# Altium schematic sheet capacitors.SchDoc
size 420 x 297 mm; Address1: Address1; Address2: Address2; Address3: Address3; Address4: Address4; SheetNumber: 1; Scale: 1:1; Разраб.: Иванов; Обозначение документа: АБВГ.123456.001 Э3; Пров.: Петров; Утв.: Сидоров; Наименование организации: ОАО "Концерн "МПО-Гидроприбор"; Перв. применение: АБВГ.123456.000; Наименование изделия 1: Плата; Наименование изделия 2: Схема электрическая; Наименование изделия 3: принципиальная; Нач. отд.: Нач. отд.; Фамилия нач. отд.: Сидоров
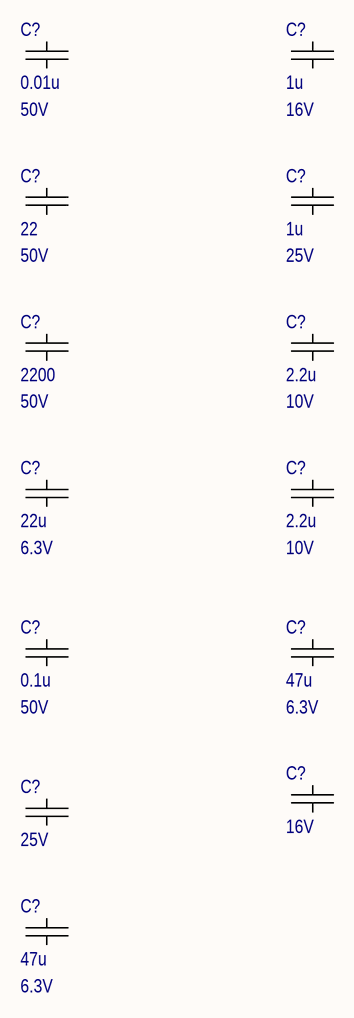
[diagram p0: capacitors.SchDoc]

## Parts
(Parts that share a designator on the sheet are numbered #1, #2 ... from top to bottom, then left to right.)
C?#1  value 0.01u  Voltage/Power: 50V  [C0603_IPC]
C?#2  value 1u  Voltage/Power: 16V  [C0603_IPC]
C?#3  value 22  Voltage/Power: 50V  [C0603_IPC]
C?#4  value 1u  Voltage/Power: 25V  [C0603_IPC]
C?#5  value 2200  Voltage/Power: 50V  [C0603_IPC]
C?#6  value 2.2u  Voltage: 10V  [C0603_IPC]  (hidden comment: 2.2u 10V)
C?#7  value 22u  Voltage/Power: 6.3V  [C0805_IPC]
C?#8  value 2.2u  Voltage/Power: 10V  [C0603_IPC]
C?#9  value 0.1u  Voltage/Power: 50V  [C0603_IPC]
C?#10  value 47u  Voltage/Power: 6.3V  [C0805_IPC]
C?#11  Voltage/Power: 16V  [C0603_IPC]
C?#12  Voltage/Power: 25V  [C0603_IPC]
C?#13  value 47u  Voltage/Power: 6.3V  [C0805_IPC]

## Nets

Not connected (* = marked no-connect by the designer): C?#1 1 2; C?#2 1 2; C?#3 1 2; C?#4 1 2; C?#5 1 2; C?#6 1 2; C?#7 1 2; C?#8 1 2; C?#9 1 2; C?#10 1 2; C?#11 1 2; C?#12 1 2; C?#13 1 2

## Notes on the sheet
- Перв. примен.
- Справ. №
- Подп. и дата
- Инв. № дубл.
- Взам. инв. №
- Разраб.
- Изм.
- Лист
- № докум.
- Подп.
- Дата
- Лит.
- Масса
- Масштаб
- Пров.
- Т.контр.
- Листов
- Инв. № подл.
- Утв.
- Н.контр.
- Копировал
- Формат А3

## Library data of the parts
C?#1 = 0.01u 50V: 0.01uF ±10% 50V Ceramic Capacitor X7R 0603 (1608 Metric); MPN: CC0603KRX7R9BB103; Manufacturer: Yageo; Tolerance: 0,1; Name: 0.01u 50V; LibraryPath: _library\sch\cap.schlib; FootprintPath: _library\pcb\capSmd.pcblib; ComponentLink2URL: https://www.digikey.com/product-detail/en/yageo/CC0603KRX7R9BB103/311-1085-2-ND/302819; ComponentLink2Description: site; Type: X7R; price elitan 1000pc: 0.54; price terra 1000pc: 0.62
C?#2 C?#11 = 1u 16V: 1µF ±10% 16V Ceramic Capacitor X7R 0603 (1608 Metric); MPN: CC0603KRX7R7BB105; Manufacturer: Yageo; Name: 1u 16V; Tolerance: 0,1; LibraryPath: _library\sch\cap.schlib; FootprintPath: _library\pcb\capSmd.pcblib; ComponentLink2URL: https://www.digikey.com/product-detail/en/yageo/CC0603KRX7R9BB104/311-1344-2-ND/2103082; ComponentLink2Description: site; Type: X7R; price elitan 1000pc: 0.97; price terra 1000pc: 2.5
C?#3 = 22p 50V: 22pF ±5% 50V Ceramic Capacitor C0G, NP0 0603 (1608 Metric); MPN: CC0603JRNPO9BN220; Manufacturer: Yageo; Name: 22p 50V; Tolerance: 0,05; Type: C0G/NPO; LibraryPath: _library\sch\cap.schlib; FootprintPath: _library\pcb\capSmd.pcblib; ComponentLink2URL: https://www.digikey.com/product-detail/en/yageo/CC0603JRNPO9BN220/311-1062-2-ND/302796; ComponentLink2Description: site; price elitan 1000pc: 0.62; price terra 1000pc: 0.65
C?#4 C?#12 = 1u 25V: 1µF ±10% 25V Ceramic Capacitor X7R 0603 (1608 Metric); MPN: CL10B105KA8NNNC; Manufacturer: Samsung; Name: 1u 25V; Tolerance: 0,1; LibraryPath: _library\sch\cap.schlib; FootprintPath: _library\pcb\capSmd.pcblib; ComponentLink2URL: https://www.digikey.com/product-detail/en/samsung-electro-mechanics/CL10B105KA8NNNC/1276-1184-2-ND/3886842; ComponentLink2Description: site; Type: X7R; price elitan 1000pc: 0.85; price terra 1000pc: 0.97
C?#5 = 2200p 50V: 2200pF ±10% 50V Ceramic Capacitor X7R 0603 (1608 Metric); MPN: CC0603KRX7R9BB222; Manufacturer: Yageo; Tolerance: 0,1; Name: 2200p 50V; LibraryPath: _library\sch\cap.schlib; FootprintPath: _library\pcb\capSmd.pcblib; ComponentLink2URL: https://www.digikey.com/product-detail/en/yageo/CC0603KRX7R9BB222/311-1081-2-ND/302815; ComponentLink2Description: site; Type: X7R; price elitan 1000pc: 0.54; price terra 1000pc: 0.62
C?#6 = 2.2u 10V X7R: 2.2µF ±10% 10V Ceramic Capacitor X7R 0603 (1608 Metric); MPN: CL10B225KP8NNNC; Manufacturer: Samsung; Tolerance: 0,1; Name: 2.2u 10V X7R; LibraryPath: _library\sch\cap.schlib; FootprintPath: _library\pcb\capSmd.pcblib; ComponentLink2URL: https://www.digikey.com/product-detail/en/samsung-electro-mechanics/CL10B225KP8NNNC/1276-1134-2-ND/3886792; ComponentLink2Description: site; Type: X7R; price elitan 1000pc: 1.75; price terra 1000pc: 2.1
C?#7 = 22u 6.3V: 22µF ±20% 6.3V Ceramic Capacitor X5R 0805 (2012 Metric); MPN: CL21A226MQQNNNE; Manufacturer: Samsung Electro-Mechanics; Tolerance: 0,2; Name: 22u 6.3V; LibraryPath: sch\cap.schlib; FootprintPath: pcb\capSmd.pcblib; ComponentLink2URL: https://www.digikey.com/product-detail/en/samsung-electro-mechanics/CL21A226MQQNNNE/1276-1100-2-ND/3886758; ComponentLink2Description: site; Type: X5R; price elitan 1000pc: 1.67; price terra 1000pc: 1.6
C?#8 = 2.2u 10V X5R: 2.2µF ±10% 10V Ceramic Capacitor X5R 0603 (1608 Metric); MPN: CL10A225KP8NNNC; Manufacturer: Samsung; Tolerance: 0,1; Name: 2.2u 10V X5R; LibraryPath: _library\sch\cap.schlib; FootprintPath: _library\pcb\capSmd.pcblib; ComponentLink2URL: https://www.digikey.com/product-detail/en/samsung-electro-mechanics/CL10A225KP8NNNC/1276-1085-2-ND/3886743; ComponentLink2Description: site; Type: X5R; price elitan 1000pc: 0.75; price terra 1000pc: 0.78
C?#9 = 0.1u 50V: 0.1uF ±10% 50V Ceramic Capacitor X7R 0603 (1608 Metric); MPN: CL10B104KB8NNND; Manufacturer: Samsung; Tolerance: 0,1; Name: 0.1u 50V; LibraryPath: _library\sch\cap.schlib; FootprintPath: _library\pcb\capSmd.pcblib; ComponentLink2URL: https://www.digikey.com/product-detail/en/yageo/CC0603KRX7R9BB104/311-1344-2-ND/2103082; ComponentLink2Description: site; Type: X7R; price elitan 1000pc: 0.63; price terra 1000pc: 0.65
C?#10 C?#13 = 47u 6.3V: 47µF ±20% 6.3V Ceramic Capacitor X5R 0805 (2012 Metric); MPN: CC0805MKX5R5BB476; Manufacturer: Yageo; Tolerance: 0,2; Name: 47u 6.3V; LibraryPath: sch\cap.schlib; FootprintPath: pcb\capSmd.pcblib; ComponentLink2URL: https://www.digikey.com/product-detail/en/yageo/CC0805MKX5R5BB476/311-1897-2-ND/5195303; ComponentLink2Description: site; Type: X5R; price elitan 1000pc: 8.62; price terra 1000pc: 9.9; price chipdip 1000pc: 9.1